# Altium schematic sheet CSI_Camera_Bridge.SchDoc: CSI camera bridge
size A3; Project: STM32MP15x-EVAL; Date: Not used; ApprovedBy: Not used; CheckedBy: Not used; Author: Not used; CompanyName: STMicroelectronics; DrawnBy: Not used; Engineer: Not used; Organization: Not used; Address1: Not used; Address2: Not used; Address3: Not used; Address4: Not used; DocumentNumber: 11; Revision: Not used; SheetNumber: 11; SheetTotal: 17; CurrentTime: Not used; CurrentDate: Not used; Time: Not used; DocumentFullPathAndName: Not used; DocumentName: Not used; ModifiedDate: Not used; ImagePath: Not used; ProjectName: Not used; Application_BuildNumber: Not used
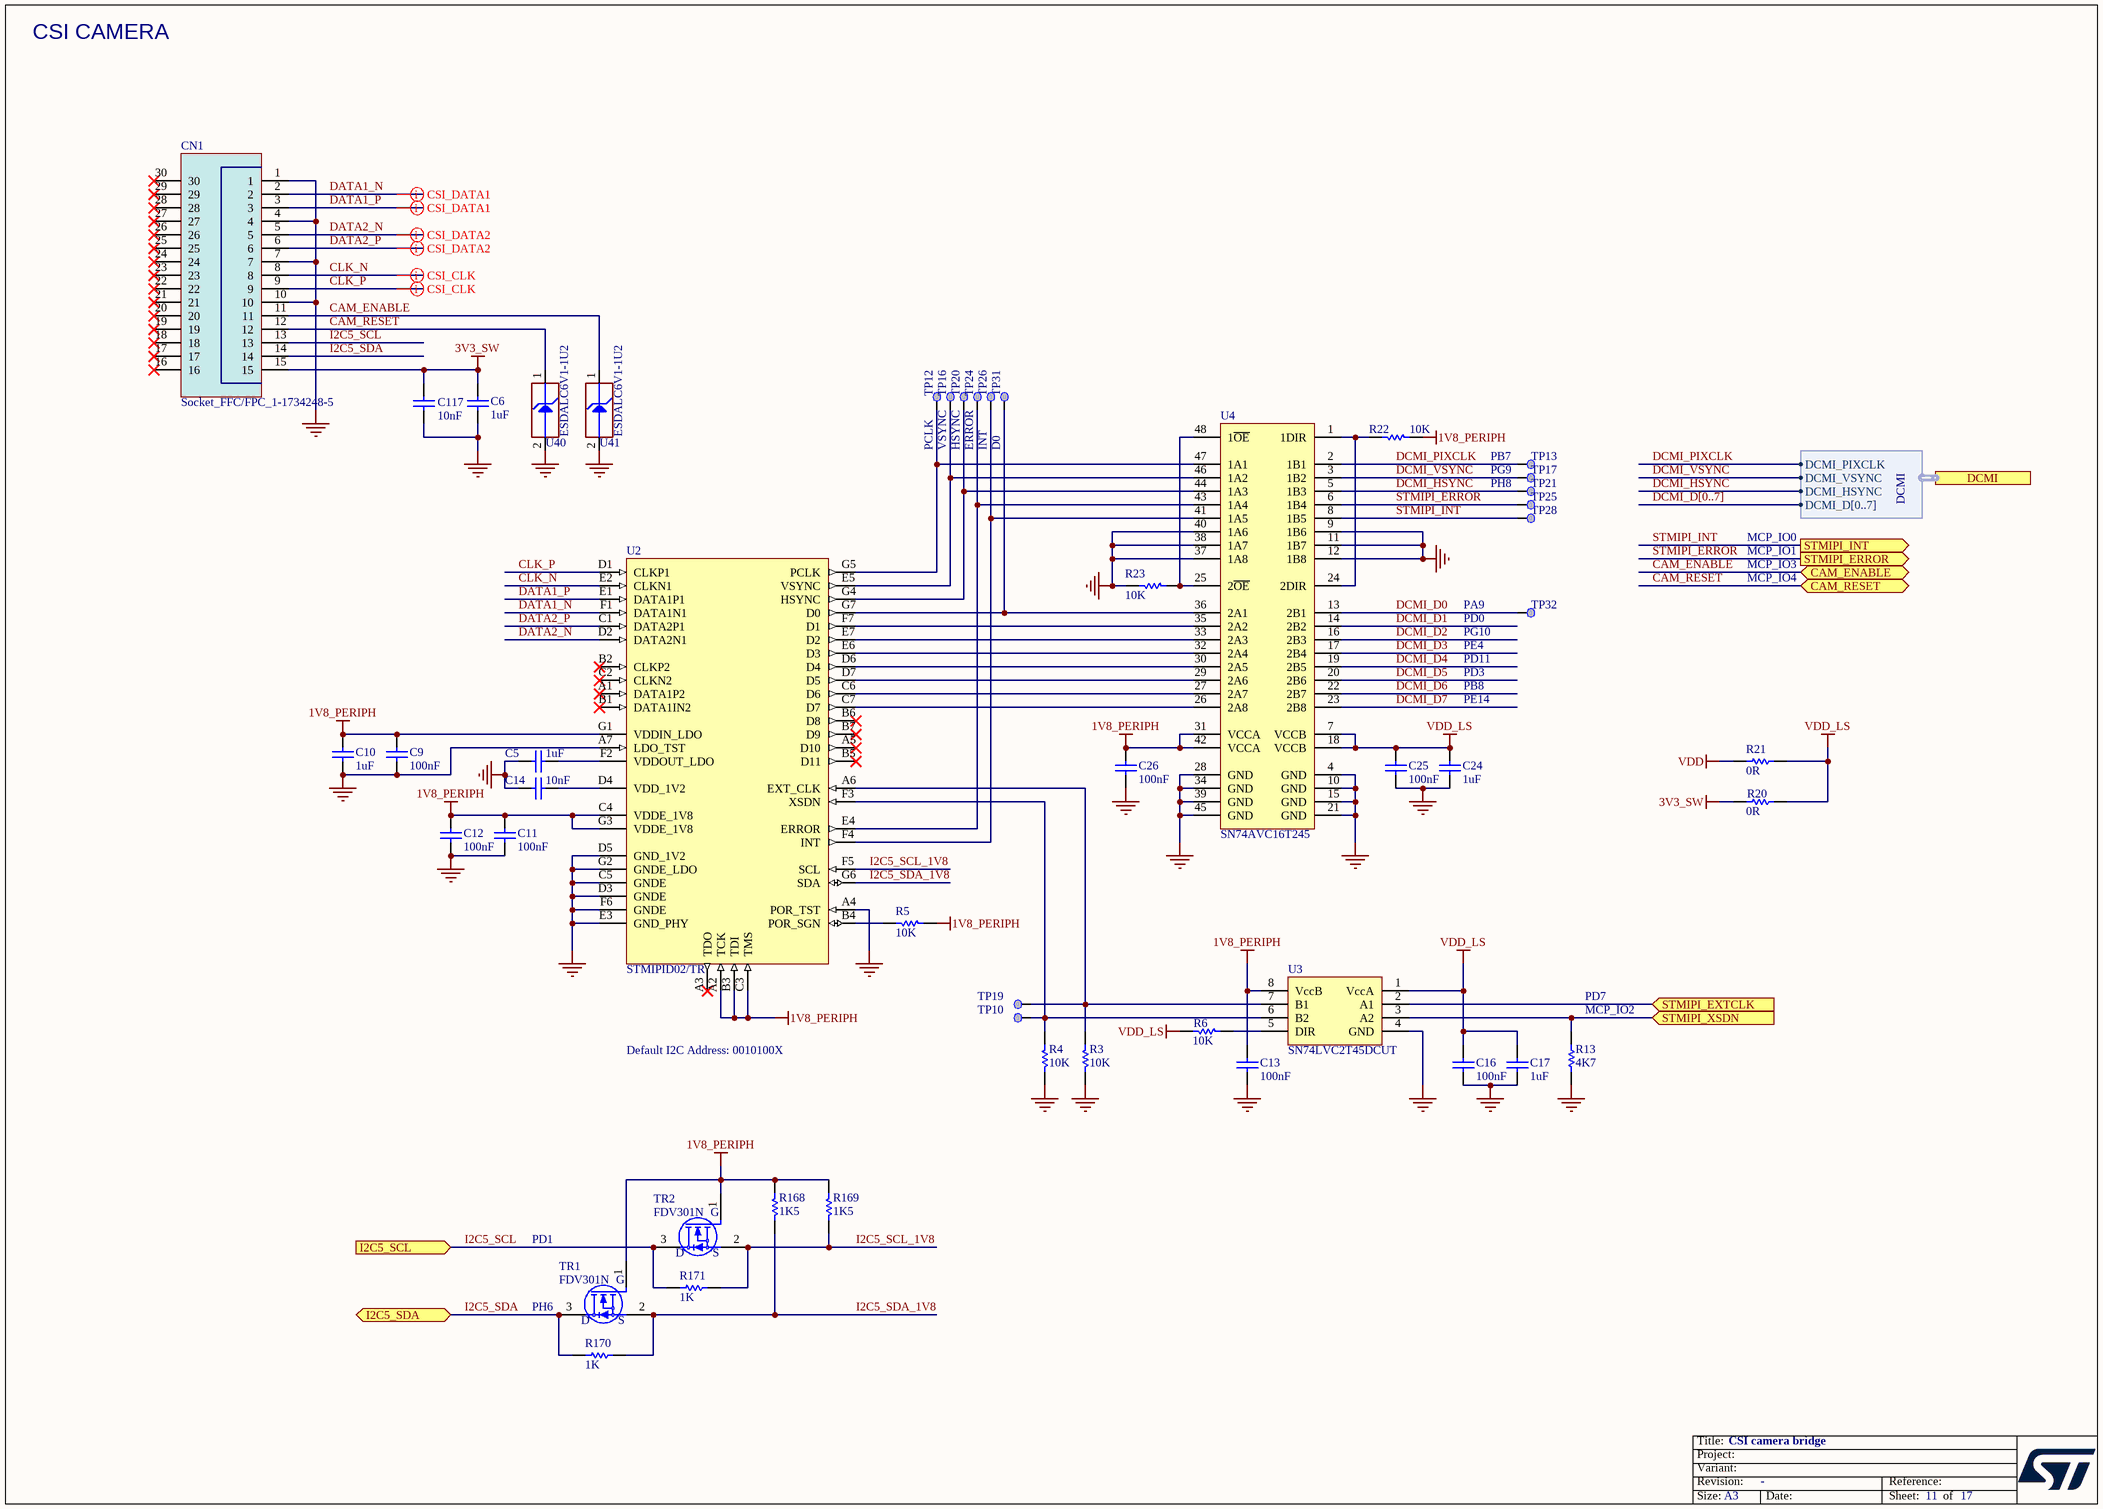
[diagram p0: CSI_Camera_Bridge.SchDoc]

## Parts
C5  value 1uF  [C0201_MURATA_GRM033_H0P3]  (hidden comment: Capacitor)
C6  value 1uF  [C0402]  (hidden comment: Capacitor)
C9  value 100nF  [C0402]  (hidden comment: Capacitor)
C10  value 1uF  [C0201_MURATA_GRM033_H0P3]  (hidden comment: Capacitor)
C11  value 100nF  [C0402]  (hidden comment: Capacitor)
C12  value 100nF  [C0402]  (hidden comment: Capacitor)
C13  value 100nF  [C0402]  (hidden comment: Capacitor)
C14  value 10nF  [C0402]  (hidden comment: Capacitor)
C16  value 100nF  [C0402]  (hidden comment: Capacitor)
C17  value 1uF  [C0201_MURATA_GRM033_H0P3]  (hidden comment: Capacitor)
C24  value 1uF  [C0201_MURATA_GRM033_H0P3]  (hidden comment: Capacitor)
C25  value 100nF  [C0402]  (hidden comment: Capacitor)
C26  value 100nF  [C0402]  (hidden comment: Capacitor)
C117  value 10nF  [C0402]  (hidden comment: Capacitor)
CN1  Socket_FFC/FPC_1-1734248-5  [CON_TE-CONNECTIVITY_1-1734248-5]
R3  value 10K  [R0402]  (hidden comment: Resistor)
R4  value 10K  [R0402]  (hidden comment: Resistor)
R5  value 10K  [R0402]  (hidden comment: Resistor)
R6  value 10K  [R0402]  (hidden comment: Resistor)
R13  value 4K7  [R0402]  (hidden comment: Resistor)
R20  value 0R  [R0402]  (hidden comment: Resistor)
R21  value 0R  [R0402]  (hidden comment: Resistor)
R22  value 10K  [R0402]  (hidden comment: Resistor)
R23  value 10K  [R0402]  (hidden comment: Resistor)
R168  value 1K5  [R0402]  (hidden comment: Resistor)
R169  value 1K5  [R0402]  (hidden comment: Resistor)
R170  value 1K  [R0402]  (hidden comment: Resistor)
R171  value 1K  [R0402]  (hidden comment: Resistor)
TP10  Test Point  [TP_SMD_1MM]  (value not drawn)  (no BOM)
TP12  Test Point  [TP_SMD_1MM]  (value not drawn)  (no BOM)
TP13  Test Point  [TP_SMD_1MM]  (value not drawn)  (no BOM)
TP16  Test Point  [TP_SMD_1MM]  (value not drawn)  (no BOM)
TP17  Test Point  [TP_SMD_1MM]  (value not drawn)  (no BOM)
TP19  Test Point  [TP_SMD_1MM]  (value not drawn)  (no BOM)
TP20  Test Point  [TP_SMD_1MM]  (value not drawn)  (no BOM)
TP21  Test Point  [TP_SMD_1MM]  (value not drawn)  (no BOM)
TP24  Test Point  [TP_SMD_1MM]  (value not drawn)  (no BOM)
TP25  Test Point  [TP_SMD_1MM]  (value not drawn)  (no BOM)
TP26  Test Point  [TP_SMD_1MM]  (value not drawn)  (no BOM)
TP28  Test Point  [TP_SMD_1MM]  (value not drawn)  (no BOM)
TP31  Test Point  [TP_SMD_1MM]  (value not drawn)  (no BOM)
TP32  Test Point  [TP_SMD_1MM]  (value not drawn)  (no BOM)
TR1  value FDV301N  [MOS_SOT23]  (hidden comment: BSN20)
TR2  value FDV301N  [MOS_SOT23]  (hidden comment: BSN20)
U2  value STMIPID02/TR  [ICC_VFBGA49_3X3_P040]  (hidden comment: STMIPID02)
U3  SN74LVC2T45DCUT  [ICC_VSSOP8_DCU_R-PDSO-G8_2X2P30_P050]
U4  SN74AVC16T245  [ICC_TVSOP48_9P8X6P6_P040]
U40  value ESDALC6V1-1U2  [ESD_ST0201]  (hidden comment: ESD-TRANSIL)
U41  value ESDALC6V1-1U2  [ESD_ST0201]  (hidden comment: ESD-TRANSIL)

## Ports
CAM_ENABLE (bidir), CAM_RESET (bidir), DCMI (harness DCMI), I2C5_SCL (in), I2C5_SDA (bidir), STMIPI_ERROR (out), STMIPI_EXTCLK (in), STMIPI_INT (out), STMIPI_XSDN (in)

## Harnesses
DCMI: DCMI_D[0..7], DCMI_HSYNC, DCMI_VSYNC, DCMI_PIXCLK

## Nets
1V8_PERIPH: C9.2 C10.2 C11.2 C12.2 C13.2 C26.2 R5.1 R22.2 R168.2 R169.2 TR1.1(G) TR2.1(G) U2.A2(TCK) U2.B3(TDI) U2.C3(TMS) U2.C4(VDDE_1V8) U2.G1(VDDIN_LDO) U2.G3(VDDE_1V8) U3.8(VccB) U4.31(VCCA) U4.42(VCCA)
3V3_SW: C6.2 C117.2 CN1.15 R20.2
GND: C5.1 C6.1 C9.1 C10.1 C11.1 C12.1 C13.1 C14.1 C16.1 C17.1 C24.1 C25.1 C26.1 C117.1 CN1.1 CN1.4 CN1.7 CN1.10 R3.2 R4.2 R13.1 R23.2 U2.A4(POR_TST) U2.A7(LDO_TST) U2.C5(GNDE) U2.D3(GNDE) U2.D5(GND_1V2) U2.E3(GND_PHY) U2.F6(GNDE) U2.G2(GNDE_LDO) U3.4(GND) U4.4(GND) U4.9(1B6) U4.10(GND) U4.11(1B7) U4.12(1B8) U4.15(GND) U4.21(GND) U4.28(GND) U4.34(GND) U4.37(1A8) U4.38(1A7) U4.39(GND) U4.40(1A6) U4.45(GND) U40.2(GND) U41.2(GND)
VDD: R21.2
VDD_LS: C16.2 C17.2 C24.2 C25.2 R6.2 R20.1 R21.1 U3.1(VccA) U4.7(VCCB) U4.18(VCCB)
CAM_ENABLE: CN1.11 U41.1(IO1) ; port CAM_ENABLE
CAM_RESET: CN1.12 U40.1(IO1) ; port CAM_RESET
CLK_N: CN1.8 U2.E2(CLKN1)
CLK_P: CN1.9 U2.D1(CLKP1)
DATA1_N: CN1.2 U2.F1(DATA1N1)
DATA1_P: CN1.3 U2.E1(DATA1P1)
DATA2_N: CN1.5 U2.D2(DATA2N1)
DATA2_P: CN1.6 U2.C1(DATA2P1)
DCMI_D0: TP32.1 U4.13(2B1)
DCMI_D1: U4.14(2B2)
DCMI_D2: U4.16(2B3)
DCMI_D3: U4.17(2B4)
DCMI_D4: U4.19(2B5)
DCMI_D5: U4.20(2B6)
DCMI_D6: U4.22(2B7)
DCMI_D7: U4.23(2B8)
DCMI_HSYNC: TP21.1 U4.5(1B3) ; port DCMI.DCMI_HSYNC
DCMI_PIXCLK: TP13.1 U4.2(1B1) ; port DCMI.DCMI_PIXCLK
DCMI_VSYNC: TP17.1 U4.3(1B2) ; port DCMI.DCMI_VSYNC
I2C5_SCL: CN1.13 R171.2 TR2.3(D) ; port I2C5_SCL
I2C5_SCL_1V8: R169.1 R171.1 TR2.2(S) U2.F5(SCL)
I2C5_SDA: CN1.14 R170.2 TR1.3(D) ; port I2C5_SDA
I2C5_SDA_1V8: R168.1 R170.1 TR1.2(S) U2.G6(SDA)
STMIPI_ERROR: TP25.1 U4.6(1B4) ; port STMIPI_ERROR
STMIPI_EXTCLK: U3.2(A1) ; port STMIPI_EXTCLK
STMIPI_INT: TP28.1 U4.8(1B5) ; port STMIPI_INT
STMIPI_XSDN: R13.2 U3.3(A2) ; port STMIPI_XSDN
NetC5_2: C5.2 U2.F2(VDDOUT_LDO)
NetC14_2: C14.2 U2.D4(VDD_1V2)
NetR3_1: R3.1 TP19.1 U2.A6(EXT_CLK) U3.7(B1)
NetR4_1: R4.1 TP10.1 U2.F3(XSDN) U3.6(B2)
NetR5_2: R5.2 U2.B4(POR_SGN)
NetR6_1: R6.1 U3.5(DIR)
NetR22_1: R22.1 U4.1(1DIR) U4.24(2DIR)
NetR23_1: R23.1 U4.25(2~{OE}) U4.48(1~{OE})
NetTP12_1: TP12.1 U2.G5(PCLK) U4.47(1A1)
NetTP16_1: TP16.1 U2.E5(VSYNC) U4.46(1A2)
NetTP20_1: TP20.1 U2.G4(HSYNC) U4.44(1A3)
NetTP24_1: TP24.1 U2.E4(ERROR) U4.43(1A4)
NetTP26_1: TP26.1 U2.F4(INT) U4.41(1A5)
NetTP31_1: TP31.1 U2.G7(D0) U4.36(2A1)
NetU2_C6: U2.C6(D6) U4.27(2A7)
NetU2_C7: U2.C7(D7) U4.26(2A8)
NetU2_D6: U2.D6(D4) U4.30(2A5)
NetU2_D7: U2.D7(D5) U4.29(2A6)
NetU2_E6: U2.E6(D3) U4.32(2A4)
NetU2_E7: U2.E7(D2) U4.33(2A3)
NetU2_F7: U2.F7(D1) U4.35(2A2)

Not connected (* = marked no-connect by the designer): CN1 16* 17* 18* 19* 20* 21* 22* 23* 24* 25* 26* 27* 28* 29* 30*; U2 A1(DATA1P2)* A3(TDO)* A5(D10)* B1(DATA1IN2)* B2(CLKP2)* B5(D11)* B6(D8)* B7(D9)* C2(CLKN2)*

## Buses and harness runs
bus DCMI_D[0..7]

## Layout directives
differential pair: CLK_N, CLK_P, DATA1_N, DATA1_P, DATA2_N, DATA2_P

## Notes on the sheet
- CSI CAMERA
- PCLK
- VSYNC
- HSYNC
- ERROR
- INT
- D0
- PH8
- PG9
- PB7
- MCP_IO1
- MCP_IO0
- MCP_IO4
- MCP_IO3
- (near TP32) PA9
- (near TP32) PD0
- (near TP32) PG10
- PE4
- PD11
- PD3
- PB8
- PE14
- Default I2C Address: 0010100X
- (near R13) PD7
- (near R13) MCP_IO2
- PD1
- PH6
- Title:
- Project:
- Size:
- Revision:
- Variant:
- A3
- -
- Date:
- Reference:
- Sheet:
- of

## Library data of the parts
C5 C10 C17 C24 = MCD-02377: Capacitor, MLCC, 1uF, 6.3V, X5R, +/-20%, 0201, T=0,3mm; Manufacturer_Part_Number: GRM033R60J105MEA2; Manufacturer: MURATA; Part_Preference: Recommended; Order_Code_RS: 820-0643; Component_Country_Of_Origin: Japan; ShowFields: YES; ID: 4483; Internal_Part_Number: MCD-02377; Status: Checked; Part_Type: Capacitor; Package: 0201; ComponentLink1URL: http://tunmcdsvn.tun.st.com/Component_Documentation_Library/Trunk/Capacitor/MURATA_GRM_Series/GRM033R60J105MEA2/; Order_Code_Digikey: 490-7229-2-ND; Order_Code_Farnell: 2470448
C6 = MCD-00095: Capacitor, MLCC, 1uF, 25V, X5R, +/-10%, 0402, T=0.5mm; Manufacturer_Part_Number: GRM155R61E105KA12; Manufacturer: MURATA; Part_Preference: Recommended; Order_Code_RS: 846-7287; Component_Country_Of_Origin: Japan; ShowFields: YES; ID: 2772; Internal_Part_Number: MCD-00095; Status: Released; Part_Type: Capacitor; Package: 0402; ComponentLink1URL: http://tunmcdsvn.tun.st.com/Component_Documentation_Library/Trunk/Capacitor/MURATA_GRM_Series; Order_Code_Digikey: 490-10017-1-ND; Order_Code_Farnell: 2218855
C9 C11-C13 C16 C25 C26 = MCD-00006: Capacitor, MLCC, 100nF, 16V, X7R, +/-10%, 0402, T=0.5mm; Manufacturer_Part_Number: CC0402KRX7R7BB104; Manufacturer: YAGEO; Part_Preference: Recommended; Order_Code_RS: 616-9701; Component_Country_Of_Origin: China; ShowFields: YES; ID: 2474; Internal_Part_Number: MCD-00006; Status: Released; Part_Type: Capacitor; Package: 0402; ComponentLink1URL: http://tunmcdsvn.tun.st.com/Component_Documentation_Library/Trunk/Capacitor/YAGEO_X7R_Series; Order_Code_Digikey: 311-1338-1-ND; Order_Code_Farnell: 9402047
C14 = MCD-02198: Capacitor, MLCC, 10nF, 50V, X7R, +/-10%, 0402, T=0.5mm; Manufacturer_Part_Number: CC0402KRX7R9BB103; Manufacturer: YAGEO; Part_Preference: Recommended; Order_Code_RS: 6169644; Component_Country_Of_Origin: China; ShowFields: YES; ID: 4298; Internal_Part_Number: MCD-02198; Status: Checked; Part_Type: Capacitor; Package: 0402; ComponentLink1URL: http://tunmcdsvn.tun.st.com/Component_Documentation_Library/Trunk/Capacitor/YAGEO_X7R_Series; Order_Code_Digikey: N/A; Order_Code_Farnell: N/A
C117 = MCD-02198: Capacitor, MLCC, 10nF, 50V, X7R, +/-10%, 0402, T=0.5mm; Part_Preference: Recommended; Manufacturer: YAGEO; Manufacturer_Part_Number: CC0402KRX7R9BB103; Order_Code_RS: 6169644; Component_Country_Of_Origin: China; ShowFields: YES; ID: 4298; Internal_Part_Number: MCD-02198; Status: Checked; Part_Type: Capacitor; Package: 0402; ComponentLink1URL: http://tunmcdsvn.tun.st.com/Component_Documentation_Library/Trunk/Capacitor/YAGEO_X7R_Series; Order_Code_Digikey: N/A; Order_Code_Farnell: N/A
CN1 = MCD-02225: Socket_FFC/FPC, 15pins, 1mm ,VR, SMD, T=7.7mm; Part_Preference: Recommended; Part_Type: Connector; Manufacturer: TE CONNECTIVITY; Component_Country_Of_Origin: Taiwan; ShowFields: YES; ID: 4325; ComponentLink1URL: http://tunmcdsvn.tun.st.com/Component_Documentation_Library/Trunk/Connector/TE_CONNECTIVITY_1734248_Series/; Internal_Part_Number: MCD-02225; Value: Socket_FFC/FPC_1-1734248-5; Status: Released; Manufacturer_Part_Number: 1-1734248-5; Order_Code_Digikey: A101418TR-ND; Order_Code_Farnell: 2890893; Order_Code_RS: N/A
R3 R4 R6 R22 R23 = MCD-00053: Resistor, 10K, 0402, +/-1%, 1/16W; Part_Preference: Recommended; Manufacturer: YAGEO; Manufacturer_Part_Number: RC0402FR-0710KL; BMS_Part_Number: 9131590; Component_Country_Of_Origin: China; ShowFields: YES; ID: 2539; Internal_Part_Number: MCD-00053; Status: Released; Part_Type: Resistor; Package: 0402; ComponentLink1URL: http://tunmcdsvn.tun.st.com/Component_Documentation_Library/Trunk/Resistor/YAGEO_RC_L_Series; Order_Code_Digikey: 311-10.0KLRCT-ND; Order_Code_Farnell: 9239359; Order_Code_RS: N/A
R5 = MCD-00053: Resistor, 10K, 0402, +/-1%, 1/16W; BMS_Part_Number: 9131590; Part_Preference: Recommended; Manufacturer: YAGEO; Manufacturer_Part_Number: RC0402FR-0710KL; Component_Country_Of_Origin: China; ShowFields: YES; ID: 2539; Internal_Part_Number: MCD-00053; Status: Released; Part_Type: Resistor; Package: 0402; ComponentLink1URL: http://tunmcdsvn.tun.st.com/Component_Documentation_Library/Trunk/Resistor/YAGEO_RC_L_Series; Order_Code_Digikey: 311-10.0KLRCT-ND; Order_Code_Farnell: 9239359; Order_Code_RS: N/A
R13 = MCD-00065: Resistor, 4K7, 0402, +/-1%, 1/16W; Manufacturer_Part_Number: RC0402FR-074K7L; Manufacturer: YAGEO; Part_Preference: Recommended; Component_Country_Of_Origin: China; ShowFields: YES; ID: 2526; Internal_Part_Number: MCD-00065; Status: Released; Part_Type: Resistor; Package: 0402; ComponentLink1URL: http://tunmcdsvn.tun.st.com/Component_Documentation_Library/Trunk/Resistor/YAGEO_RC_L_Series; Order_Code_Digikey: 311-4.7KLRCT-ND; Order_Code_Farnell: 9239316; Order_Code_RS: N/A
R20 R21 = MCD-00052: Resistor, 0R, 0402, +/-5%, 1/16W; Part_Preference: Recommended; Manufacturer: YAGEO; Manufacturer_Part_Number: RC0402JR-070RL; Order_Code_RS: 618-5804; Component_Country_Of_Origin: China; ShowFields: YES; ID: 2540; Internal_Part_Number: MCD-00052; Status: Released; Part_Type: Resistor; Package: 0402; ComponentLink1URL: http://tunmcdsvn.tun.st.com/Component_Documentation_Library/Trunk/Resistor/YAGEO_RC_L_Series; Order_Code_Digikey: 311-0.0JRCT-ND; Order_Code_Farnell: 9232516RL
R168 R169 = MCD-00068: Resistor, 1K5, 0402, +/-1%, 1/16W; Part_Preference: Recommended; Manufacturer: YAGEO; Manufacturer_Part_Number: RC0402FR-071K5L; Component_Country_Of_Origin: China; ShowFields: YES; ID: 2524; Internal_Part_Number: MCD-00068; Status: Released; Part_Type: Resistor; Package: 0402; ComponentLink1URL: http://tunmcdsvn.tun.st.com/Component_Documentation_Library/Trunk/Resistor/YAGEO_RC_L_Series; Order_Code_Digikey: 311-1.50KLRCT-ND; Order_Code_Farnell: 9239251; Order_Code_RS: N/A
R170 R171 = MCD-00061: Resistor, 1K, 0402, +/-1%,1/16W; Part_Preference: Recommended; Manufacturer: YAGEO; Manufacturer_Part_Number: RC0402FR-071KL; Component_Country_Of_Origin: China; ShowFields: YES; ID: 2532; Internal_Part_Number: MCD-00061; Status: Released; Part_Type: Resistor; Package: 0402; ComponentLink1URL: http://tunmcdsvn.tun.st.com/Component_Documentation_Library/Trunk/Resistor/YAGEO_RC_L_Series; Order_Code_Digikey: 311-1.00KLRCT-ND; Order_Code_Farnell: 9239235; Order_Code_RS: N/A
TP10 TP12 TP13 TP16 TP17 TP19-TP21 TP24-TP26 TP28 TP31 TP32 = MCD-00074: Test Point 1mm; Part_Type: Misc; Part_Preference: Recommended; ShowFields: YES; ID: 2518; Internal_Part_Number: MCD-00074; Status: Released; ComponentLink1URL: http://na; Manufacturer: N/A; Manufacturer_Part_Number: N/A; Order_Code_Digikey: N/A; Order_Code_Farnell: N/A; Order_Code_RS: N/A
TR1 TR2 = MCD-02156: MOSFET, N-Channel , Vds: 25V, Id: 0,22A, Vgs(th): 1.06V, Vgs(max): +/-8V, Rdson:5ohm@Vgs=2.7V, Qg=0,49nC; Part_Preference: Recommended; Part_Type: Transistor; Manufacturer: ON SEMICONDUCTOR; Component_Country_Of_Origin: China; ShowFields: YES; ID: 4256; Internal_Part_Number: MCD-02156; Status: Released; Manufacturer_Part_Number: FDV301N; Package: SOT23-3; ComponentLink1URL: http://tunmcdsvn.tun.st.com/Component_Datasheet_Library/Trunk/Transistors/ON_SEMICONDUCTOR_MOSFET_FDN301N; Order_Code_Digikey: N/A; Order_Code_Farnell: N/A; Order_Code_RS: N/A
U2 = MCD-02213: Dual mode MIPI CSI-2 / SMIA CCP2 de-serializer; Part_Preference: Recommended; Part_Type: IC; Manufacturer: STMICROELECTRONICS; Manufacturer_HQ_COO: EU; Component_Country_Of_Origin: Malaysia; ShowFields: YES; ID: 4313; Order_Code_Digikey: N/A; Order_Code_Farnell: N/A; Order_Code_RS: N/A; Status: Released; ComponentLink1URL: http://tunmcdsvn.tun.st.com/Component_Datasheet_Library/Trunk/IC/STM_STMIPID02_MIPI deserializer; Internal_Part_Number: MCD-02213; Manufacturer_Part_Number: STMIPID02/TR; Package: VFBGA 49-ball, 3x3x1mm, 0.4mm pitch
U3 = MCD-00264: Dual bit dual supply bus transceiver; BMS_Part_Number: 9169311; Part_Preference: Recommended; Part_Type: IC; Manufacturer: TEXAS INSTRUMENTS; Component_Country_Of_Origin: Thailand; ShowFields: YES; ID: 2605; Internal_Part_Number: MCD-00264; Value: SN74LVC2T45DCUT; Status: Released; Manufacturer_Part_Number: SN74LVC2T45DCUT; ComponentLink1URL: http://tunmcdsvn.tun.st.com/Component_Datasheet_Library/Trunk/IC/TI_Dual_bit_tranceiver_SN74LVC2T45
U4 = MCD-02226: 16-bit translating transceiver; Part_Preference: Recommended; Part_Type: IC; Manufacturer: TEXAS INSTRUMENTS; Manufacturer_Part_Number: SN74AVC16T245DGVR; Component_Country_Of_Origin: Malaysia; ShowFields: YES; ID: 4326; Internal_Part_Number: MCD-02226; Value: SN74AVC16T245; Status: Released; Package: TVSOP,  56-ball 4.5x7mm, 0.65mm pitch; ComponentLink1URL: http://tunmcdsvn.tun.st.com/Component_Datasheet_Library/Trunk/IC/TI_16-bit_translating_transceiver_SN74AVC16T245; Order_Code_Digikey: N/A; Order_Code_Farnell: N/A; Order_Code_RS: N/A
U40 U41 = MCD-00170: ESD protection 6V1; BMS_Part_Number: 9151132; Part_Type: Diode; Part_Preference: Recommended; Manufacturer: STMICROELECTRONICS; Manufacturer_HQ_COO: EU; Component_Country_Of_Origin: China; ShowFields: YES; ID: 2696; Internal_Part_Number: MCD-00170; Status: Released; Manufacturer_Part_Number: ESDALC6V1-1U2; ComponentLink1URL: http://tunmcdsvn.tun.st.com/Component_Datasheet_Library/Trunk/Diodes/STM_ESD_ESDALC6V1-1U2